# Altium schematic sheet LarixEDUV3b_1.SchDoc: Larix EDU V3
size A3; DrawnBy: AAM; Organization: MCI; DocumentNumber: 1; Revision: V3.0; SheetNumber: 2; SheetTotal: 2; ProjectName: M10000760
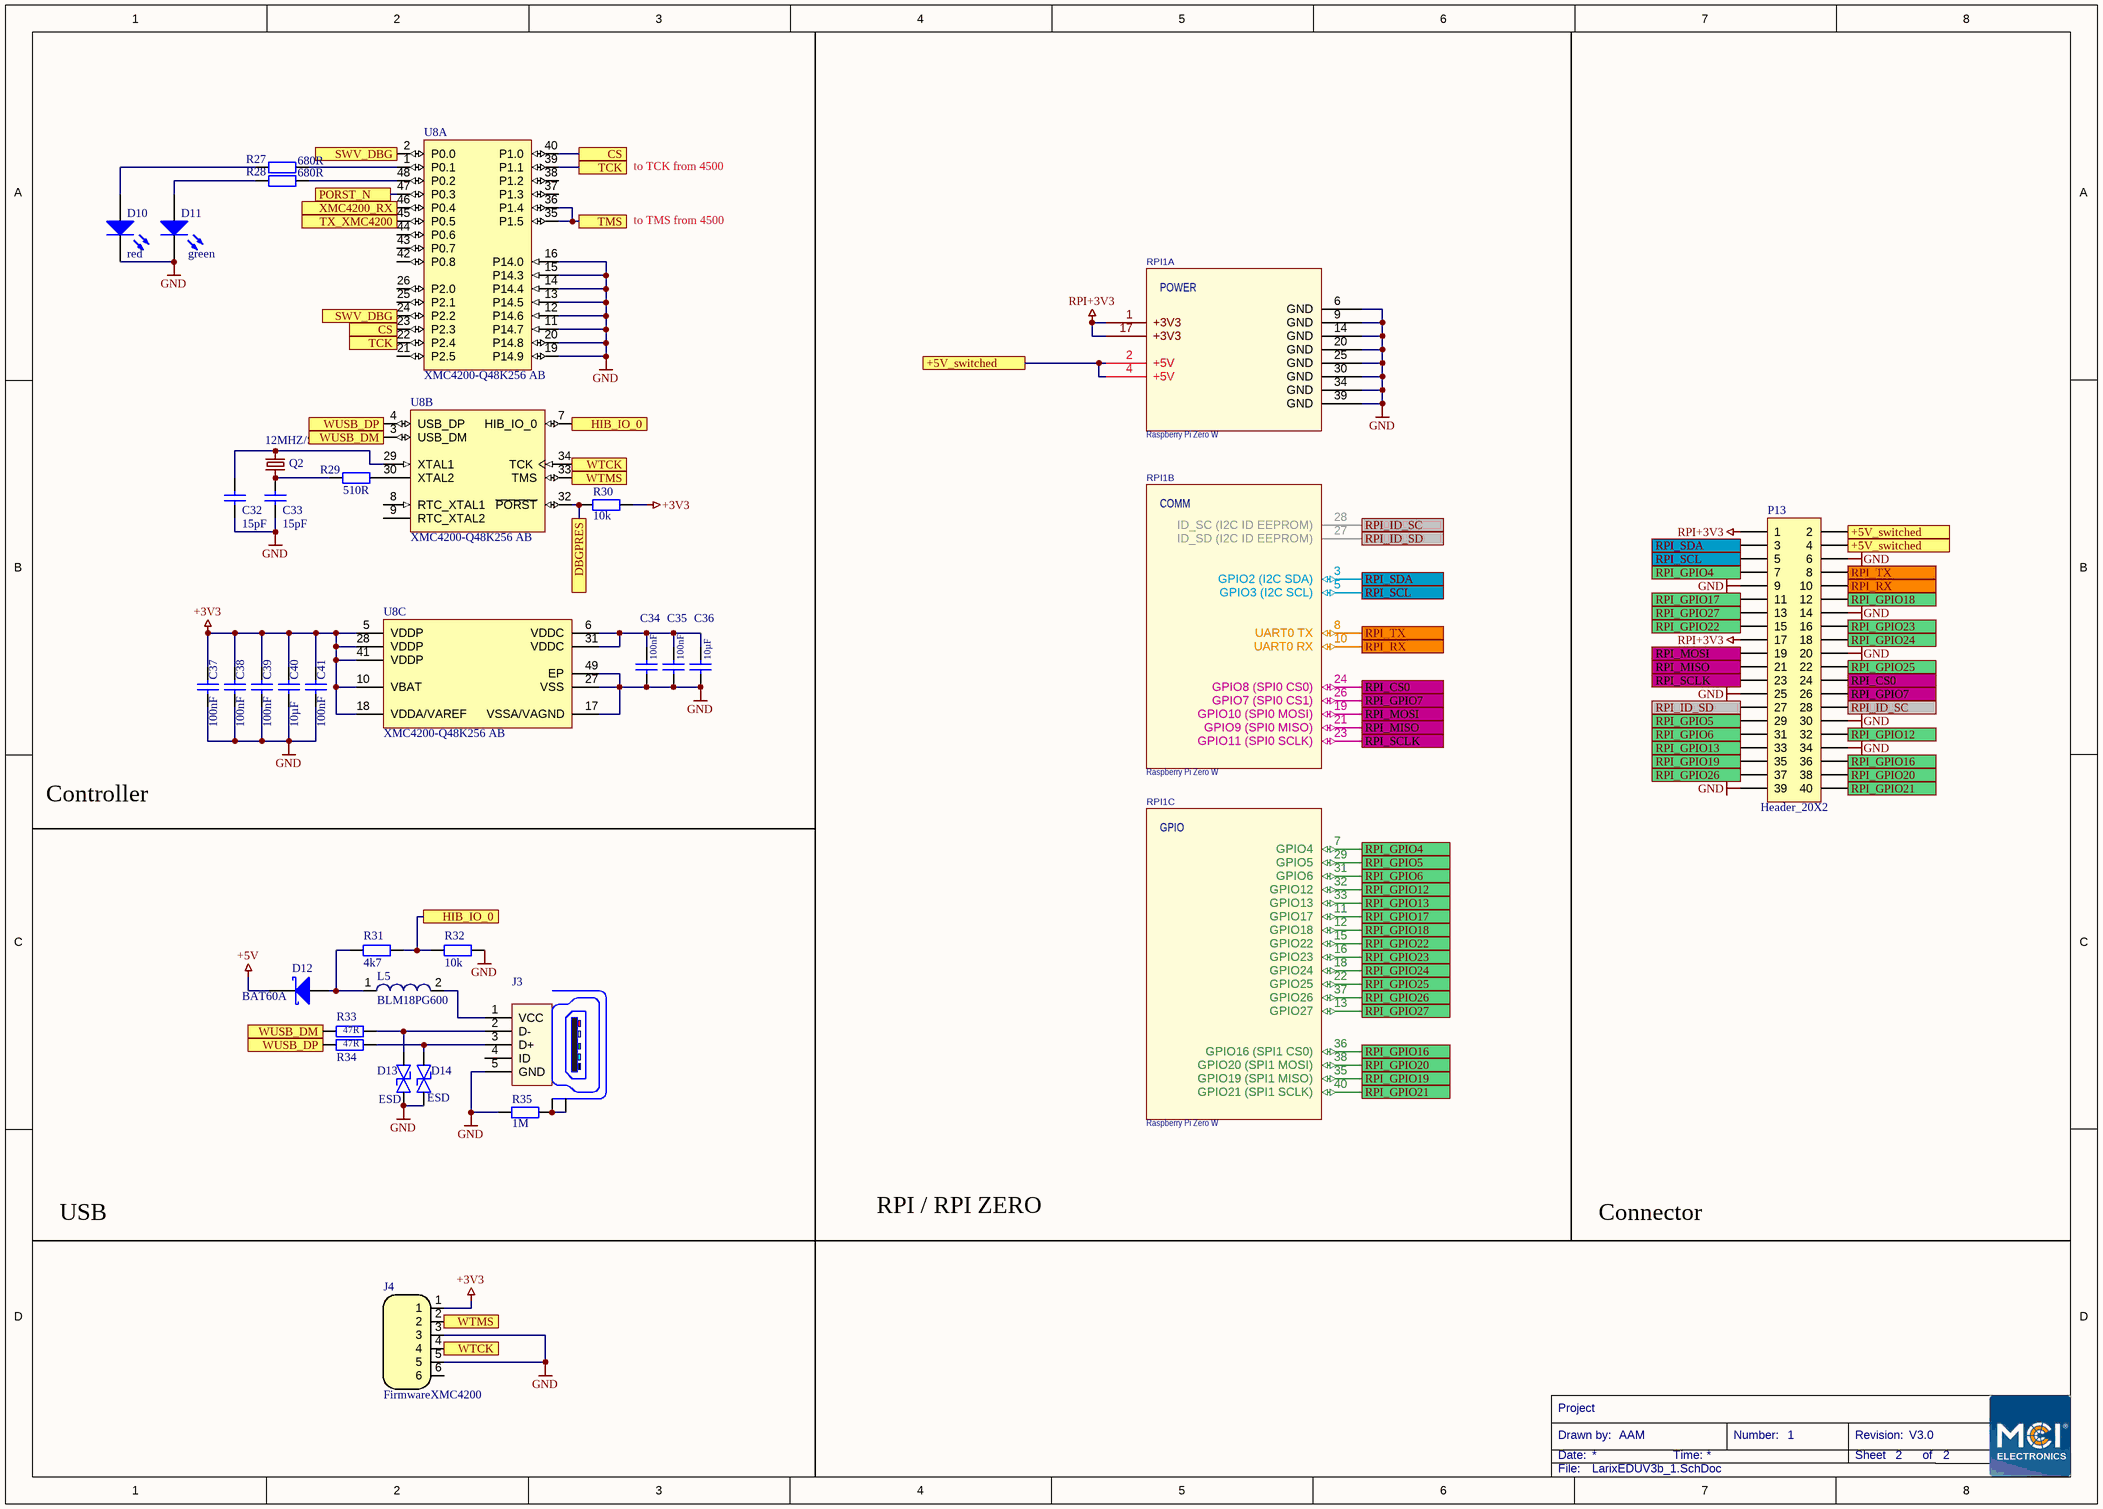
[diagram p0: LarixEDUV3b_1.SchDoc]

## Parts
C32  15pF  [_0603]
C33  15pF  [_0603]
C34  100nF  [_0603]
C35  100nF  [_0603]
C36  10µF  [_0603]
C37  100nF  [_0603]
C38  100nF  [_0603]
C39  100nF  [_0603]
C40  10µF  [_0603]
C41  100nF  [_0603]
D10  red  [LED_0603]
D11  green  [LED_0603]
D12  BAT60A  [SOD-323]
D13  ESD  [TSLP_2_17]
D14  ESD  [TSLP_2_17]
J3  629105150921  [629105150921]  (value not drawn)
J4  FirmwareXMC4200  [TagConnect_6pol]  (no BOM)
L5  BLM18PG600  [SMD 0603]
P13  Header_20X2  [Header_20X2]
Q2  12MHZ/S/3.2X2.5  [32X25_4PAD]
R27  680R  [_0603]
R28  680R  [_0603]
R29  510R  [_0603]
R30  10k  [_0603]
R31  4k7  [_0603]
R32  10k  [_0603]
R33  47R  [_0603]
R34  47R  [_0603]
R35  1M  [_0603]
RPI1  Raspberry Pi Zero W  [RPI_ZERO]  (parts A,B,C of 3)
U8  XMC4200-Q48K256 AB  [INF-PG-VQFN-48-53-5200X5200TP_N]  (parts A,B,C of 3)

## Ports
+5V_switched, CS, DBGPRES, HIB_IO_0, PORST_N, RPI_CS0, RPI_GPIO4, RPI_GPIO5, RPI_GPIO6, RPI_GPIO7, RPI_GPIO12, RPI_GPIO13, RPI_GPIO16, RPI_GPIO17, RPI_GPIO18, RPI_GPIO19, RPI_GPIO20, RPI_GPIO21, RPI_GPIO22, RPI_GPIO23, RPI_GPIO24, RPI_GPIO25, RPI_GPIO26, RPI_GPIO27, RPI_ID_SC, RPI_ID_SD, RPI_MISO, RPI_MOSI, RPI_RX (in), RPI_SCL, RPI_SCLK, RPI_SDA, RPI_TX (out), SWV_DBG, TCK, TMS, TX_XMC4200 (out), WTCK, WTMS, WUSB_DM, WUSB_DP, XMC4200_RX (in)

## Nets
+3V3: C37.2 C38.2 C39.2 C40.2 C41.2 J4.1 R30.1 U8.5(VDDP) U8.10(VBAT) U8.18(VDDA/VAREF) U8.28(VDDP) U8.41(VDDP)
+5V: D12.1(K)
GND: C32.1 C33.1 C34.1 C35.1 C36.1 C37.1 C38.1 C39.1 C40.1 C41.1 D10.2 D11.2 D13.1 D14.1 J3.5(GND) J4.3 J4.5 P13.6 P13.9 P13.14 P13.20 P13.25 P13.30 P13.34 P13.39 R32.2 R35.1 RPI1.6(GND) RPI1.9(GND) RPI1.14(GND) RPI1.20(GND) RPI1.25(GND) RPI1.30(GND) RPI1.34(GND) RPI1.39(GND) U8.11(P14.7) U8.12(P14.6) U8.13(P14.5) U8.14(P14.4) U8.15(P14.3) U8.16(P14.0) U8.17(VSSA/VAGND) U8.19(P14.9) U8.20(P14.8) U8.27(VSS) U8.49(EP)
RPI+3V3: P13.1 P13.17 RPI1.1(+3V3) RPI1.17(+3V3)
+5V_switched: P13.2 P13.4 RPI1.2(+5V) RPI1.4(+5V) ; port +5V_switched
CS: U8.23(P2.3) U8.40(P1.0) ; port CS
DBGPRES: R30.2 U8.32(~{PORST}) ; port DBGPRES
HIB_IO_0: R31.2 R32.1 U8.7(HIB_IO_0) ; port HIB_IO_0
PORST_N: U8.47(P0.3) ; port PORST_N
RPI_CS0: P13.24 RPI1.24(GPIO8_(SPI0_CS0)) ; port RPI_CS0
RPI_GPIO4: P13.7 RPI1.7(GPIO4) ; port RPI_GPIO4
RPI_GPIO5: P13.29 RPI1.29(GPIO5) ; port RPI_GPIO5
RPI_GPIO6: P13.31 RPI1.31(GPIO6) ; port RPI_GPIO6
RPI_GPIO7: P13.26 RPI1.26(GPIO7_(SPI0_CS1)) ; port RPI_GPIO7
RPI_GPIO12: P13.32 RPI1.32(GPIO12) ; port RPI_GPIO12
RPI_GPIO13: P13.33 RPI1.33(GPIO13) ; port RPI_GPIO13
RPI_GPIO16: P13.36 RPI1.36(GPIO16_(SPI1_CS0)) ; port RPI_GPIO16
RPI_GPIO17: P13.11 RPI1.11(GPIO17) ; port RPI_GPIO17
RPI_GPIO18: P13.12 RPI1.12(GPIO18) ; port RPI_GPIO18
RPI_GPIO19: P13.35 RPI1.35(GPIO19_(SPI1_MISO)) ; port RPI_GPIO19
RPI_GPIO20: P13.38 RPI1.38(GPIO20_(SPI1_MOSI)) ; port RPI_GPIO20
RPI_GPIO21: P13.40 RPI1.40(GPIO21_(SPI1_SCLK)) ; port RPI_GPIO21
RPI_GPIO22: P13.15 RPI1.15(GPIO22) ; port RPI_GPIO22
RPI_GPIO23: P13.16 RPI1.16(GPIO23) ; port RPI_GPIO23
RPI_GPIO24: P13.18 RPI1.18(GPIO24) ; port RPI_GPIO24
RPI_GPIO25: P13.22 RPI1.22(GPIO25) ; port RPI_GPIO25
RPI_GPIO26: P13.37 RPI1.37(GPIO26) ; port RPI_GPIO26
RPI_GPIO27: P13.13 RPI1.13(GPIO27) ; port RPI_GPIO27
RPI_ID_SC: P13.28 RPI1.28(ID_SC_(I2C_ID_EEPROM)) ; port RPI_ID_SC
RPI_ID_SD: P13.27 RPI1.27(ID_SD_(I2C_ID_EEPROM)) ; port RPI_ID_SD
RPI_MISO: P13.21 RPI1.21(GPIO9_(SPI0_MISO)) ; port RPI_MISO
RPI_MOSI: P13.19 RPI1.19(GPIO10_(SPI0_MOSI)) ; port RPI_MOSI
RPI_RX: P13.10 RPI1.10(UART0_RX) ; port RPI_RX
RPI_SCL: P13.5 RPI1.5(GPIO3_(I2C_SCL)) ; port RPI_SCL
RPI_SCLK: P13.23 RPI1.23(GPIO11_(SPI0_SCLK)) ; port RPI_SCLK
RPI_SDA: P13.3 RPI1.3(GPIO2_(I2C_SDA)) ; port RPI_SDA
RPI_TX: P13.8 RPI1.8(UART0_TX) ; port RPI_TX
SWV_DBG: U8.2(P0.0) U8.24(P2.2) ; port SWV_DBG
TCK: U8.22(P2.4) U8.39(P1.1) ; port TCK
TMS: U8.35(P1.5) U8.36(P1.4) ; port TMS
TX_XMC4200: U8.45(P0.5) ; port TX_XMC4200
WTCK: J4.4 U8.34(TCK) ; port WTCK
WTMS: J4.2 U8.33(TMS) ; port WTMS
WUSB_DM: R33.1 U8.3(USB_DM) ; port WUSB_DM
WUSB_DP: R34.1 U8.4(USB_DP) ; port WUSB_DP
XMC4200_RX: U8.46(P0.4) ; port XMC4200_RX
NetC32_2: C32.2 Q2.3 U8.29(XTAL1)
NetC33_2: C33.2 Q2.1 R29.1
NetC34_2: C34.2 C35.2 C36.2 U8.6(VDDC) U8.31(VDDC)
NetD10_1: D10.1 R27.1
NetD11_1: D11.1 R28.1
NetD12_2: D12.2(A) L5.1 R31.1
NetD13_2: D13.2 J3.2(D-) R33.2
NetD14_2: D14.2 J3.3(D+) R34.2
NetJ3_1: J3.1(VCC) L5.2
NetJ3_Z1: J3.Z1(Shield) J3.Z2(Shield) R35.2
NetR27_2: R27.2 U8.1(P0.1)
NetR28_2: R28.2 U8.48(P0.2)
NetR29_2: R29.2 U8.30(XTAL2)

Not connected (* = marked no-connect by the designer): J3 4(ID); J4 6; U8 8(RTC_XTAL1) 9(RTC_XTAL2) 21(P2.5) 25(P2.1) 26(P2.0) 37(P1.3) 38(P1.2) 42(P0.8) 43(P0.7) 44(P0.6)

## Notes on the sheet
- to TCK from 4500
- to TMS from 4500
- Controller
- USB
- RPI / RPI ZERO
- Connector
- Project
- Date:
- Drawn by:
- Time:
- Number:
- Revision:
- Sheet
- of
- ELECTRONICS
- File:
- (in symbol Misc_46, part A) POWER
- (in symbol Misc_46, part B) COMM
- (in symbol Misc_46, part C) GPIO

## Library data of the parts
C32-C41 = Cap_129: Name: Cap_0603; QR: 0; UID: Cap_129; mounting: SMD
D10 D11 = DIODE_61: Name: LED_0603_gruen; Colour: gruen; RS_number: 697-3715P; QR: 0; UID: DIODE_61; Type: LED; Name_Hyperlink: http://at.rs-online.com/web/p/products/6973715P/; mounting: SMD
D12 = BAT60A: Silicon AF Schottky Rectifier Diode with Extreme Low VF Drop; Published: 21-Mar-2003; LatestRevisionDate: 19-Mar-2004; LatestRevisionNote: Silkscreen size reduced.; DatasheetDocument: Jan-1999; PackageDocument: Sep-2000; PackageReference: SOD-323; Publisher: Altium Limited; ComponentLink1Description: Manufacturer Link; ComponentLink1URL: http://www.infineon.com/; ComponentLink2Description: Datasheet; ComponentLink2URL: http://www.infineon.com/upload/Document/cmc_upload/documents/081/715/bat60aseries_1.pdf
D13 D14 = DIODE_69: ESD101-B1-02ELS _E6327; UID: DIODE_69; Name: ESD; mounting: SMD
J3 = 629105150921: WR-COM_USB_Micro Type AB_Horizontal_SMT; Manufacturer: Würth Elektronik eiSos GmbH; ComponentLink1 Description: Manufacturer; ComponentLink2 Description: Datasheet; NoPins: 5; ComponentLink1URL: http://www.we-online.de; ComponentLink2URL: http://katalog.we-online.de/em/datasheet/629105150921.pdf; Created by: Karrer Zheng; Created Date: 10/23/2014; partNo: 629105150921
J4 = Con_76: Conector par ICD; UID: Con_76; Name: TagConnect_6pol; mounting: SMD
L5 = WE-CBF 0603, 74279260: SMD EMI Suppression Ferrite Beads WE-CBF, Z= 40 Ohm; Manufacturer: Würth Elektronik eiSos GmbH; Impedance: 40 Ohm; ComponentLink1Description: Manufacturer; ComponentLink1URL: http://www.we-online.de; Created by: Christin Zierenner; Created Date: May 2009; partNo: 74279260; ComponentLink2Description: Datasheet; ComponentLink2URL: http://www.we-online.de/katalog/media/pdf/74279260.pdf
P13 = Con_86: UID: Con_86; Name: Header_20X2; mounting: THD
Q2 = NX3225_2
R27-R35 = Res_5: Name: Res_0603; UID: Res_5; mounting: SMD
RPI1 = Misc_46: UID: Misc_46; Name: RPI_Zero; mounting: THT
U8 = XMC4200-Q48K256 AB: 80 MHz XMC4200 MCU with 256 KByte Program Memory, 40 KByte SRAM, 3.3 V, -40 to 125 degC, PG-VQFN-48, Green; Manufacturer: Infineon; A / D input lines (incl. FADC): 8; Digital I/O Lines: 21; Program Memory: 256.0 KByte; SRAM (incl. Cache): 40.0 KByte; Type of Serial I/O Interfaces: 4xSPI, Dual SPI, Quad SPI, UART, LIN, IIC, IIS; DatasheetVersion: V0.6; PackageVersion: V0.6; PackageReference: PG-VQFN-48-53; PackageDescription: 48-Pin Plastic (Green) Very Thin Profile Quad Flat Non Leaded Package, 7 x 7 mm Body, 0.5 mm Pitch; Halogen-free: TRUE; Mounting Technology: Surface Mount; PartNumber: XMC4200-Q48K256 AB; ComponentLink1Description: Manufacturer URL; ComponentLink1URL: http://www.infineon.com; ComponentLink2Description: Datasheet; ComponentLink2URL: http://www.infineon.com/dgdl/xmc4100_xmc4200_ds_v0.6_2012_11.pdf?folderId=db3a30433580b3710135a47f3eb76c98&fileId=db3a30433afc7e3e013b3cf9b2816573&location=en.Products.Microcontrollers.32-bit_Industrial_Microcontrollers_based_on_ARM__Cortex_-M.32-bit_XMC4000_Industrial_Microcontrollers_ARM__Cortex_-M4.DATASHEET.xmc4100_xmc4200_ds_v0.6_2012_11.pdf; ComponentLink3Description: Package Specification; ComponentLink3URL: http://www.infineon.com/dgdl/PG-VQFN-48-15%2C-19%2C-20%2C-22%2C-24%2C-48%2C-51%2C-52%2C-53%2C-54%2C-55%2C-56%2C-57-Package_Overview.pdf?folderId=db3a304319c6f18c0119e80a8f2559bf&fileId=db3a304319c6f18c011a0b8b18c33200